# EAGLE design PowerMinder1sch (EAGLE 6.5.0)
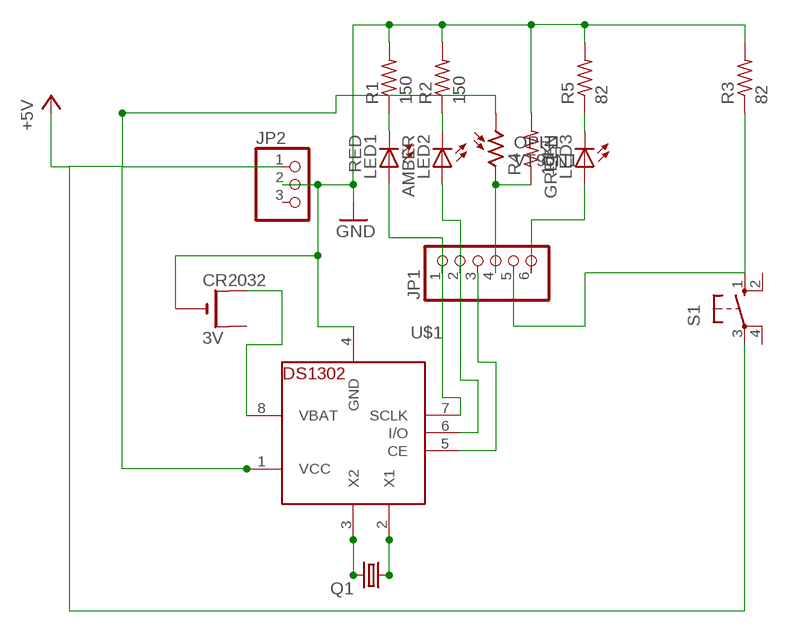
[diagram p0: schematic, sheet 1]

## Parts
CR2032  3V  CR2032THM  [CR2032-THRU]
JP1  PINHD-1X6  [1X06]
JP2  PINHD-1X3  [1X03]
LED1  RED  LED5MM  [LED5MM]
LED2  AMBER  LED5MM  [LED5MM]
LED3  GREEN  LED5MM  [LED5MM]
OPH1  VT90N1  [VT900]
Q1  CRYSTALTC26H  [TC26H]
R1  150  R-US_0207/12  [0207/12]
R2  150  R-US_0207/12  [0207/12]
R3  82  R-US_0207/12  [0207/12]
R4  10K  R-US_0207/12  [0207/12]
R5  82  R-US_0207/12  [0207/12]
S1  10-XX  [B3F-10XX]
U$1  DS1302  [DIL08-ROUND]

## Nets
+5V: JP2.1 OPH1.1 S1.3(P) U$1.1(VCC)
GND: CR2032.- JP2.2 R1.2 R2.2 R3.2 R4.2 R5.2 U$1.4(GND)
N$1: JP1.1 LED1.A U$1.7(SCLK)
N$2: JP1.2 LED2.A U$1.6(I/O)
N$3: JP1.4 OPH1.2 R4.1
N$4: JP1.6 LED3.A
N$5: LED1.K(C) R1.1
N$6: LED2.K(C) R2.1
N$7: LED3.K(C) R5.1
N$8: Q1.1 U$1.2(X1)
N$9: Q1.2 U$1.3(X2)
N$10: CR2032.+1(+) U$1.8(VBAT)
N$11: JP1.5 R3.1 S1.1(S)
N$12: JP1.3 U$1.5(CE)
Unconnected: CR2032.+2(+1) JP2.3 S1.2(S1) S1.4(P1)

## Library data of the parts
CR2032 = adafruit:CR2032
JP1 = adafruit:PINHD-1X6: PIN HEADER
JP2 = adafruit:PINHD-1X3: PIN HEADER
LED1-LED3 = adafruit:LED: LED OSRAM: - CHIPLED LG R971, LG N971, LY N971, LG Q971, LY Q971, LO R971, LY R971 LH N974, LH R974 LS Q976, LO Q976, LY Q976 LO Q996 - Hyper CHIPLED LW Q18S LB Q993, LB Q99A, LB R99A - SideLED LS A670, LO A670, LY A670, LG A670, LP A670 LB A673, LV A673, LT A673, LW A673 LH A674 LY A675 LS A676, LA A676, LO A676, LY A676, LW A676 LS A679, LY A679, LG A679 - Hyper Micro SIDELED® LS Y876, LA Y876, LO Y876, LY Y876 LT Y87S - SmartLED LW L88C, LW L88S LB L89C, LB L89S, LG L890 LS L89K, LO L89K, LY L89K LS L896, LA L896, LO L896, LY L896 - TOPLED LS T670, LO T670, LY T670, LG T670, LP T670 LSG T670, LSP T670, LSY T670, LOP T670, LYG T670 LG T671, LOG T671, LSG T671 LB T673, LV T673, LT T673, LW T673 LH T674 LS T676, LA T676, LO T676, LY T676, LB T676, LH T676, LSB T676, LW T676 LB T67C, LV T67C, LT T67C, LS T67K, LO T67K, LY T67K, LW E67C LS E67B, LA E67B, LO E67B, LY E67B, LB E67C, LV E67C, LT E67C LW T67C LS T679, LY T679, LG T679 LS T770, LO T770, LY T770, LG T770, LP T770 LB T773, LV T773, LT T773, LW T773 LH T774 LS E675, LA E675, LY E675, LS T675 LS T776, LA T776, LO T776, LY T776, LB T776 LHGB T686 LT T68C, LB T68C - Hyper Mini TOPLED® LB M676 - Mini TOPLED Santana® LG M470 LS M47K, LO M47K, LY M47K Source: http://www.osram.convergy.de/
OPH1 = photo-elements:VT9: Photoconductive Cell VT900 Series Source: http://optoelectronics.perkinelmer.com/content/Datasheets/DTS_vt900seriesdatasheet.pdf
Q1 = adafruit:CRYSTAL: CRYSTAL; OC_FARNELL: unknown; OC_NEWARK: unknown
R1-R5 = adafruit:R-US_: RESISTOR, American symbol
S1 = switch-omron:10-XX: OMRON SWITCH; MPN: B3F-1000; OC_FARNELL: 176432; OC_NEWARK: 36M3542
U$1 = adafruit:DS1302: DS1302 - Real time clock with supercap trickle charger

## Board
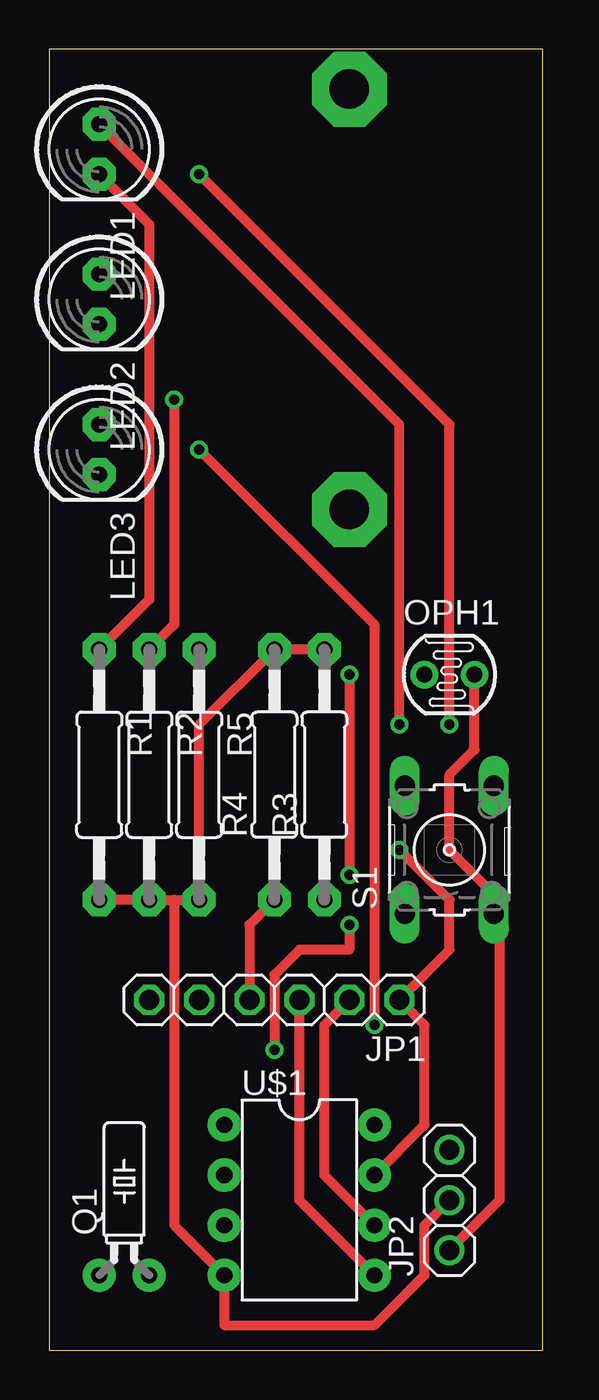
[diagram p1: board, top side]
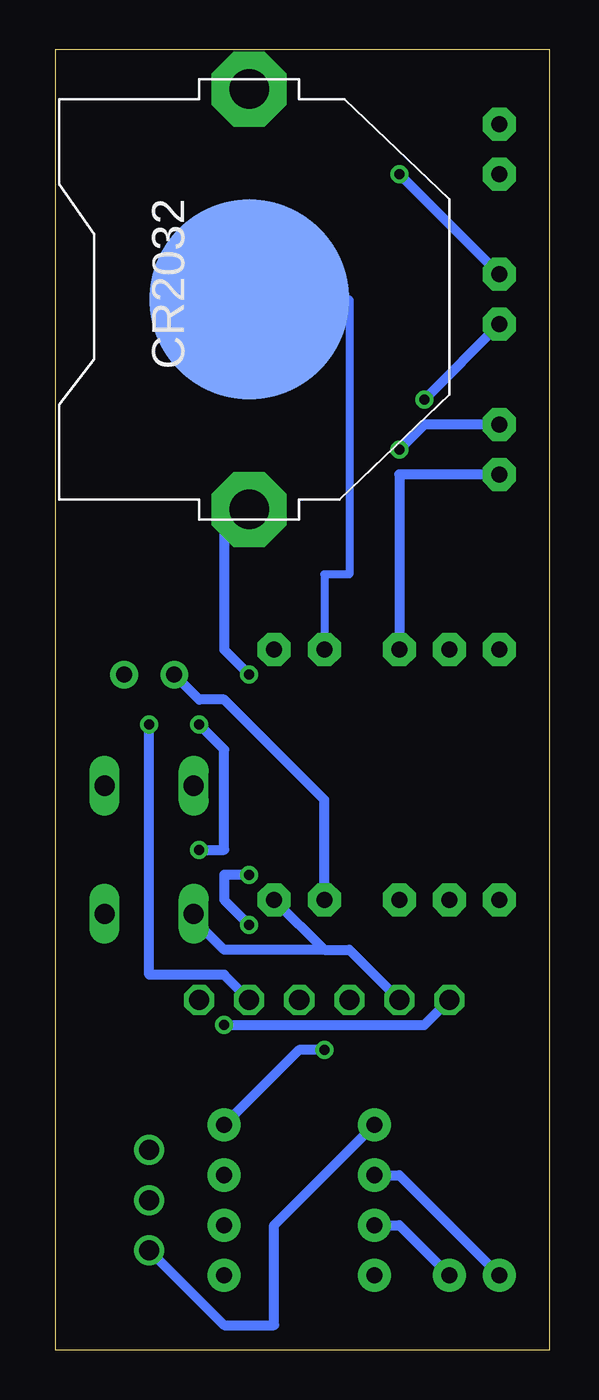
[diagram p2: board, bottom side, seen from below]

Size 25.07 x 66.03 mm. Coordinates in mm from the lower left corner, seen from the top.
Outline: 0,0 25.07,0 25.07,66.03 0,66.03 0,0
Copper layers (1*16): Top 0.035mm / dielectric 1.5mm / Bottom 0.035mm
Design rules "default *": minimum track width 20mil, minimum drill 20mil, track to track 8mil, track to pad 8mil, pad to pad 8mil, via to via 8mil, smd to smd 8mil, copper to edge 40mil, drill to drill 8mil, minimum pad ring 10mil, minimum via ring 8mil, stop-mask expansion 4mil, vias tented up to drill 0mil, thermal gap 10mil
bRestrict: area 9.7,47.8 to 20.8,58.9

### Footprints (pad centres in the part's own frame; a part is rotated, then mirrored left to right if it is on the bottom)
CR2032-THRU = drill 2 pad 3.81 octagon: +1 -10.668,0; +2 10.668,0 | smd 10.16 x 10.16: - 0,0
1X06 = drill 1.016 octagon: 1 -6.35,0; 2 -3.81,0; 3 -1.27,0; 4 1.27,0; 5 3.81,0; 6 6.35,0
1X03 = drill 1.016: 1 -2.54,0; 2 0,0; 3 2.54,0
LED5MM = drill 0.813 pad 1.676 octagon: A -1.27,0; K 1.27,0
VT900 = drill 0.8 pad 1.4: 1 -1.27,0; 2 1.27,0
TC26H = drill 0.813 pad 1.676: 1 -1.27,0; 2 1.27,0
0207/12 = drill 0.813 pad 1.676 octagon: 1 -6.35,0; 2 6.35,0
B3F-10XX = drill 1.016 long: 1 -3.251,2.261; 2 3.251,2.261; 3 -3.251,-2.261; 4 3.251,-2.261
DIL08-ROUND = drill 0.813 pad 1.676: 1 -3.81,-3.81; 2 -1.27,-3.81; 3 1.27,-3.81; 4 3.81,-3.81; 5 3.81,3.81; 6 1.27,3.81; 7 -1.27,3.81; 8 -3.81,3.81

### Placement (x,y rotation side)
CR2032  15.24,53.34 90 bottom
JP1  11.43,17.78 180 top
JP2  20.32,7.62 90 top
LED1  2.54,60.96 270 top
LED2  2.54,53.34 270 top
LED3  2.54,45.72 270 top
OPH1  20.32,34.29 180 top
Q1  3.81,3.81 0 top
R1  2.54,29.21 270 top
R2  5.08,29.21 270 top
R3  13.97,29.21 90 top
R4  11.43,29.21 90 top
R5  7.62,29.21 270 top
S1  20.32,25.4 90 top
U$1  12.7,7.62 270 top

### Tracks (layer width: path | path; a pad name or v marks a point on that pad's centre or on a via)
+5V
  Top 0.508: OPH1.1 21.59,30.48 20.32,29.21 20.32,25.4 22.86,22.86 S1.3 22.86,21.59 22.86,7.62 JP2.1
  Bottom 0.508: U$1.1 13.97,6.35 13.97,1.27 16.51,1.27 JP2.1
GND
  Top 0.508: JP2.2 19.05,6.35 19.05,3.81 16.51,1.27 8.89,1.27 U$1.4 6.35,6.35 6.35,22.86 | R3.2 R4.2 7.62,31.75 R5.2 6.35,22.86 | R1.2 R2.2 6.35,22.86
  Bottom 0.406: CR2032.- 10.16,53.34 10.16,39.37 11.43,39.37 R4.2
N$1  (via drill 0.51)
  Top 0.508: U$1.7 19.05,11.43 19.05,16.51 JP1.1 20.32,20.32 20.32,22.86 v17.78,25.4 | LED1.A 17.78,46.99 v17.78,31.75
  Bottom 0.508: v17.78,31.75 16.51,30.48 16.51,25.4 v17.78,25.4
N$2  (via drill 0.51)
  Top 0.508: JP1.2 13.97,16.51 13.97,8.89 U$1.6 | v7.62,59.69 20.32,46.99 v20.32,31.75
  Bottom 0.508: v7.62,59.69 LED2.A | v20.32,31.75 20.32,19.05 16.51,19.05 JP1.2
N$3
  Top 0.508: JP1.4 10.16,21.59 R4.1
  Bottom 0.508: OPH1.2 17.78,33.02 16.51,33.02 11.43,27.94 R4.1
N$4  (via drill 0.51)
  Top 0.508: v16.51,16.51 16.51,36.83 v7.62,45.72
  Bottom 0.508: JP1.6 6.35,16.51 v16.51,16.51 | v7.62,45.72 6.35,46.99 LED3.A
N$5
  Top 0.508: R1.1 5.08,38.1 5.08,57.15 LED1.K
N$6  (via drill 0.51)
  Top 0.508: R2.1 6.35,36.83 v6.35,48.26
  Bottom 0.508: LED2.K v6.35,48.26
N$7
  Bottom 0.508: R5.1 7.62,44.45 LED3.K
N$8
  Bottom 0.508: Q1.1 7.62,8.89 U$1.2
N$9
  Bottom 0.508: Q1.2 7.62,6.35 U$1.3
N$10  (via drill 0.51)
  Top 0.508: v11.43,15.24 11.43,19.05 12.7,20.32 15.24,20.32 v15.24,21.59 | v15.24,34.29 v15.24,24.13
  Bottom 0.508: U$1.8 12.7,15.24 v11.43,15.24 | v15.24,21.59 16.51,22.86 16.51,24.13 v15.24,24.13 | v15.24,34.29 16.51,35.56 16.51,41.91 15.24,41.91 CR2032.+1
N$11
  Bottom 0.508: JP1.5 10.16,20.32 11.43,20.32 | R3.1 11.43,20.32 | 11.43,20.32 16.51,20.32 17.78,21.59 S1.1
N$12
  Top 0.508: JP1.3 12.7,7.62 U$1.5